# Altium schematic sheet Temp.SchDoc
size A4
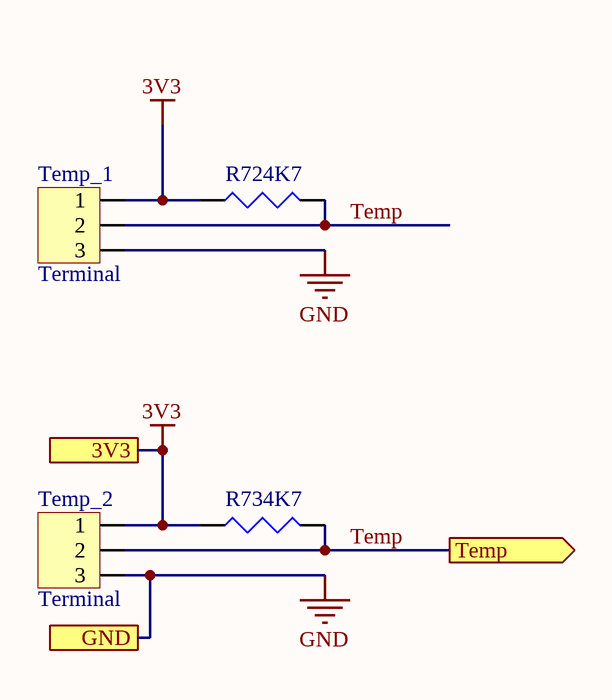
[diagram p0: Temp.SchDoc]

## Parts
R72  4K7  [J1-0603]
R73  4K7  [J1-0603]
Temp_1  Terminal  [2,54 3pin terminal]
Temp_2  Terminal  [2,54 3pin terminal]

## Ports
3V3, GND, Temp (out)

## Nets
3V3: R72.1 R73.1 Temp_1.1 Temp_2.1 ; port 3V3
GND: Temp_1.3 Temp_2.3 ; port GND
Temp: R72.2 R73.2 Temp_1.2 Temp_2.2 ; port Temp

## Library data of the parts
R72 R73 = Res3: Resistor; Published: 8-Jun-2000; LatestRevisionDate: 29-May-2009; LatestRevisionNote: IPC-7351 Footprint Added.; PackageReference: J1-0603; Publisher: Altium Limited; PackageDescription: Chip Resistor; Value: 4K7
Temp_1 Temp_2 = 2,54 3pin terminal